# EAGLE design Tracksoar v2 sd shield (EAGLE 9.3.1)
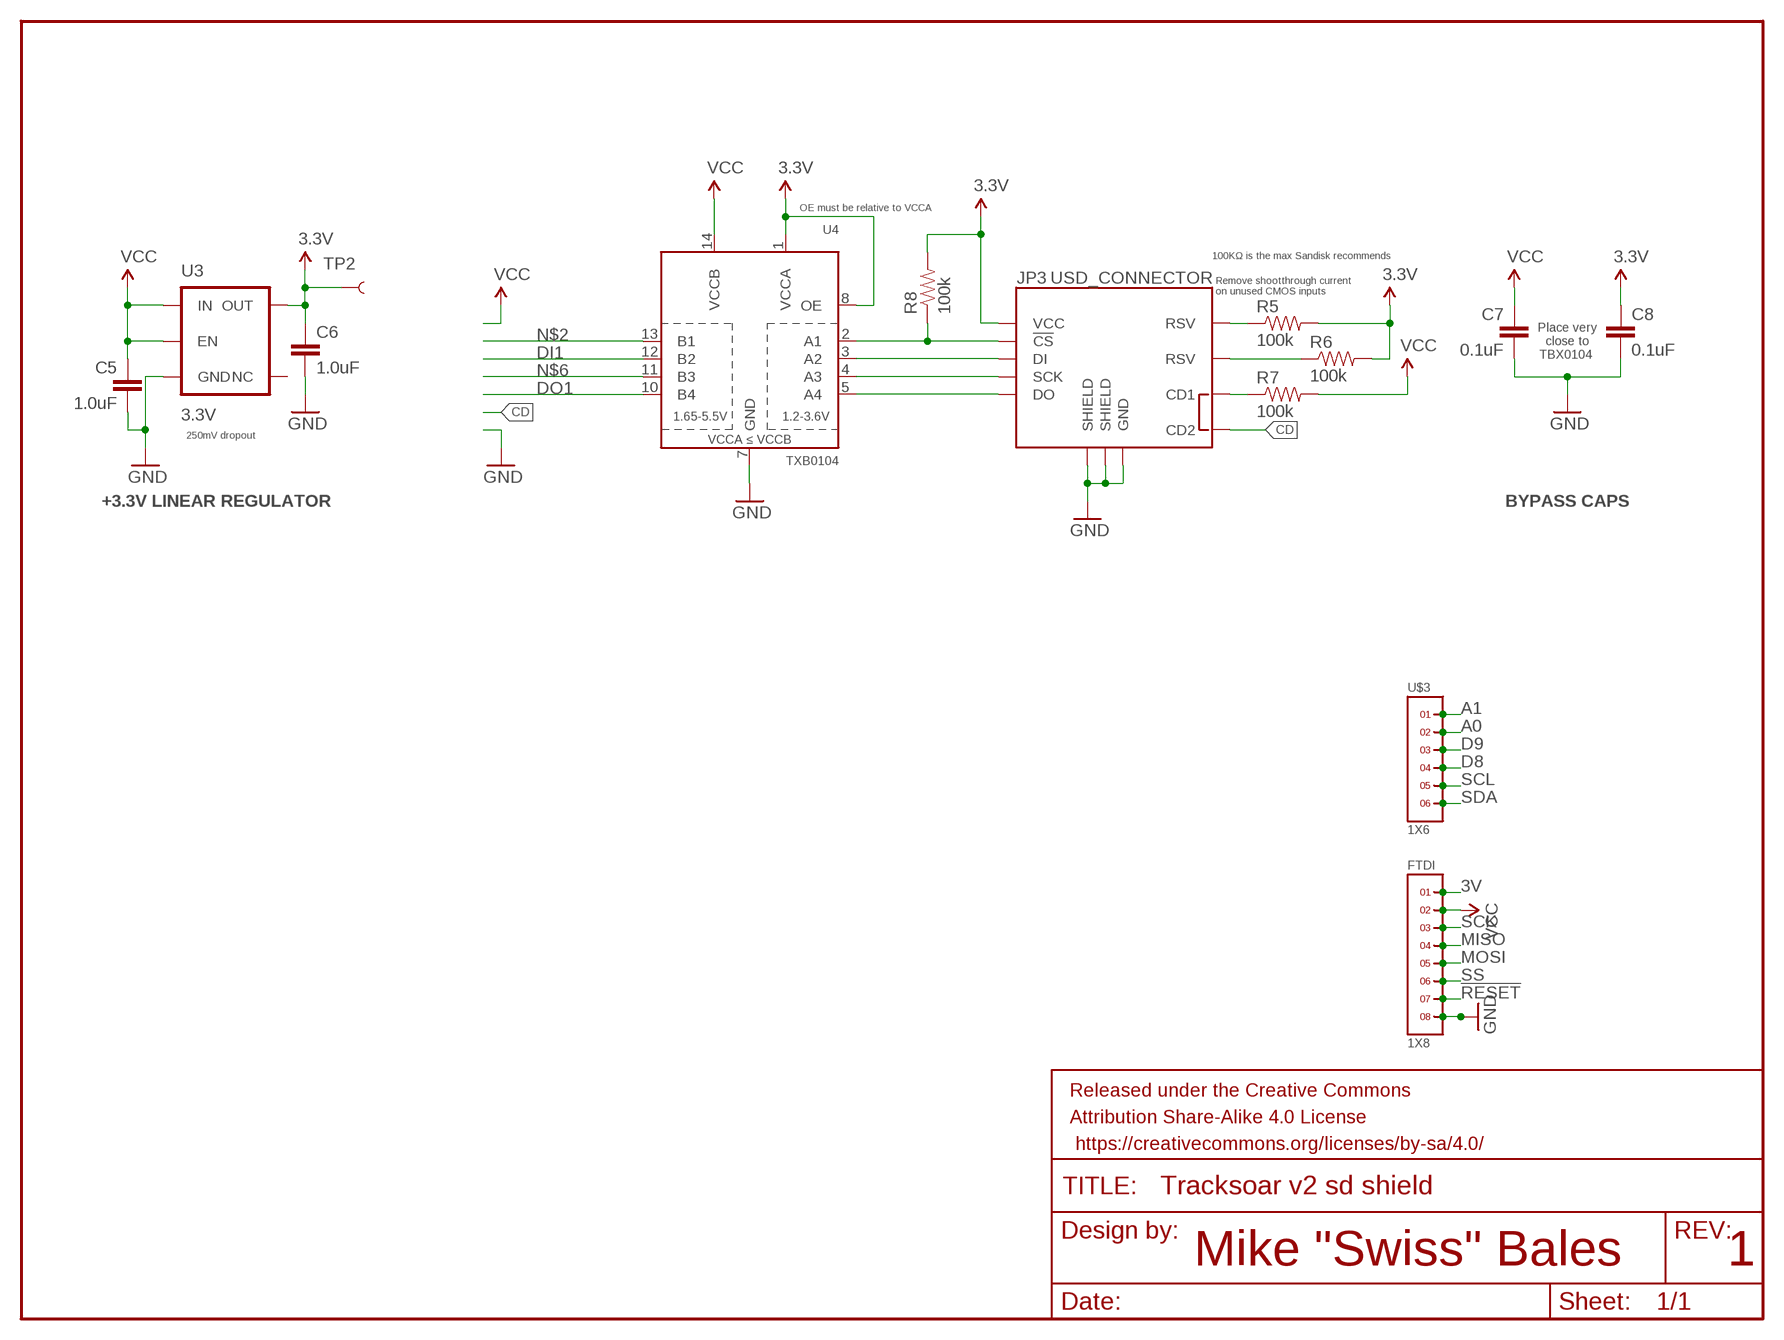
[diagram p0: schematic, sheet 1]

## Parts
C5  1.0uF  1.0UF-16V-10%(0603)  [0603-CAP]
C6  1.0uF  1.0UF-16V-10%(0603)  [0603-CAP]
C7  0.1uF  0.1UF-25V(+80/-20%)(0603)  [0603-CAP]
C8  0.1uF  0.1UF-25V(+80/-20%)(0603)  [0603-CAP]
FRAME1  FRAME-LETTER  [CREATIVE_COMMONS]
FTDI  1X8  [1X8]
JP3  USD_CONNECTOR  [MICRO-SD-SOCKET-PP]
R5  100k  100KOHM-1/10W-1%(0603)  [0603-RES]
R6  100k  100KOHM-1/10W-1%(0603)  [0603-RES]
R7  100k  100KOHM-1/10W-1%(0603)  [0603-RES]
R8  100k  100KOHM-1/10W-1%(0603)  [0603-RES]
TP2  TEST-POINT3  [PAD.03X.03]
U3  3.3V  V_REG_AP2112K-3.3V  [SOT23-5]
U4  TXB0104  TXB0104PWRSOIC14  [SO14]
U$3  1X6  [1X6]

## Nets
3V: FTDI.1
3V3: C6.1 C8.1 JP3.VCC R5.2 R6.2 R8.2 TP2.P$1 U3.5(OUT) U4.1(VCCA) U4.8(OE) ; supply symbol labelled 3.3V
!CS_3V1: JP3.CS(!CS) R8.1 U4.2(A1)
!RESET: FTDI.7
A0: U$3.2
A1: U$3.1
CD: JP3.CD2
CDSDSD1: JP3.CD1 R7.1
D8: U$3.4
D9: U$3.3
DI1: U4.12(B2)
DI_3V1: JP3.DI U4.3(A2)
DO1: U4.10(B4)
DO_3V1: JP3.DO U4.5(A4)
GND: C5.2 C6.2 C7.2 C8.2 FTDI.8 JP3.GND JP3.GND1(SHIELD) JP3.GND3(SHIELD) U3.2(GND) U4.7(GND)
MISO: FTDI.4
MOSI: FTDI.5
N$2: U4.13(B1)
N$6: U4.11(B3)
RSV@3: JP3.RSV1(RSV) R5.1
RSV@4: JP3.RSV2(RSV) R6.1
SCK: FTDI.3
SCK_3V1: JP3.SCLK(SCK) U4.4(A3)
SCL: U$3.5
SDA: U$3.6
SS: FTDI.6
VCC: FTDI.2
VDD_IO: C5.1 C7.1 R7.2 U3.1(IN) U3.3(EN) U4.14(VCCB) ; supply symbol labelled VCC
Unconnected: U3.4(NC)

## Notes on the sheet
- OE must be relative to VCCA
- 100KΩ is the max Sandisk recommends
- Remove shootthrough current
  on unused CMOS inputs
- Place very
  close to
  TBX0104
- 250mV dropout
- +3.3V LINEAR REGULATOR | BYPASS CAPS
- Mike "Swiss" Bales | 1

## Library data of the parts
C5 C6 = SparkFun-Capacitors:1.0UF-16V-10%(0603): CAP-00868; PROD_ID: CAP-00868
C7 C8 = SparkFun-Capacitors:0.1UF-25V(+80/-20%)(0603): CAP-00810 Ceramic Standard decoupling cap; PROD_ID: CAP-00810
FRAME1 = SparkFun-Aesthetics:FRAME-LETTER: Schematic Frame Standard 8.5x11 US Letter frame
FTDI = headers(2mm):1X8
JP3 = SparkFun-Connectors:USD_CONNECTOR: microSD Socket Push-push type µSD socket. Footprint production proven. Symbol has new and improved layout and naming accuracy. SparkFun Electronics SKU : PRT-00127. tDoc lines correctly indicate media card edge positions when inserting (unlocked, locked, depressed). NOTE: CD1 and CD2 are connected internally; PROD_ID: CONN-07820
R5-R8 = SparkFun-Resistors:100KOHM-1/10W-1%(0603): RES-07828; PROD_ID: RES-07828
TP2 = SparkFun-Passives:TEST-POINT: Bare copper test points for troubleshooting or ICT
U3 = SparkFun-PowerIC:V_REG_AP2112: AP2112 - 600mA CMOS LDO Regulator w/ Enable The AP2112 is CMOS process low dropout linear regulator with enable function, the regulator delivers a guaranteed 600mA (min.) continuous load current. Features Output Voltage Accuracy: ±1.5% Output Current: 600mA (Min.) Foldback Short Current Protection: 50mA Enable Function to Turn ON/OFF VOUT Low Dropout Voltage (3.3V): 250mV (Typ.) @IOUT=600mA Excellent Load Regulation: 0.2%/A (Typ.) Excellent Line Regulation: 0.02%/V (Typ.) Low Quiescent Current: 55μA (Typ.) Low Standby Current: 0.01μA (Typ.) Low Output Noise: 50μVRMS PSRR: 100Hz -65dB, 1kHz -65dB OTSD Protection Stable with 1.0μF Flexible Cap: Ceramic, Tantalum and Aluminum Electrolytic Operation Temperature Range: -40°C to 85°C ESD: MM 400V, HBM 4000V; PROD_ID: VREG-12457
U4 = SparkFun-DigitalIC:TXB0104PWR: 4-Bit Bi-Directional Level Shifter 1.2V-3.6V (VCCA) to 1.65V-5.5V (VCCB) bi-directional level shifter with auto direction sensing. Max data rate - VCCA 1.8V: 20Mbps (50ns), VCCA 3.3V: 100Mbps (10ns) Digikey: 296-21929-1-ND (TSSOP) IC-11329; PROD_ID: IC-11329
U$3 = headers(2mm):1X6

## Board
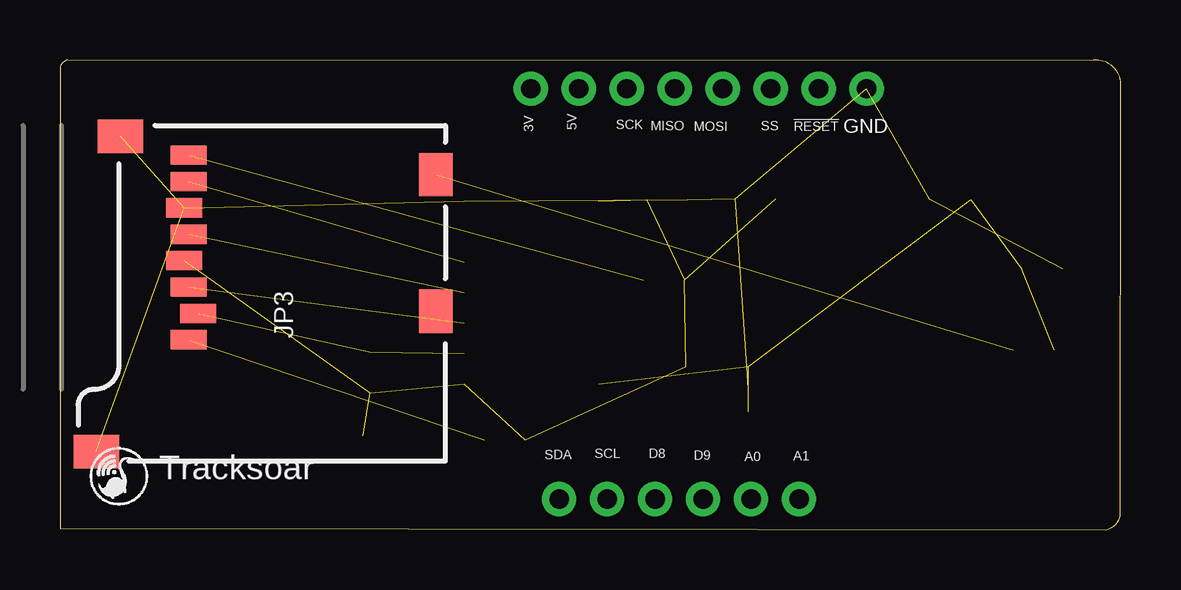
[diagram p1: board, top side]
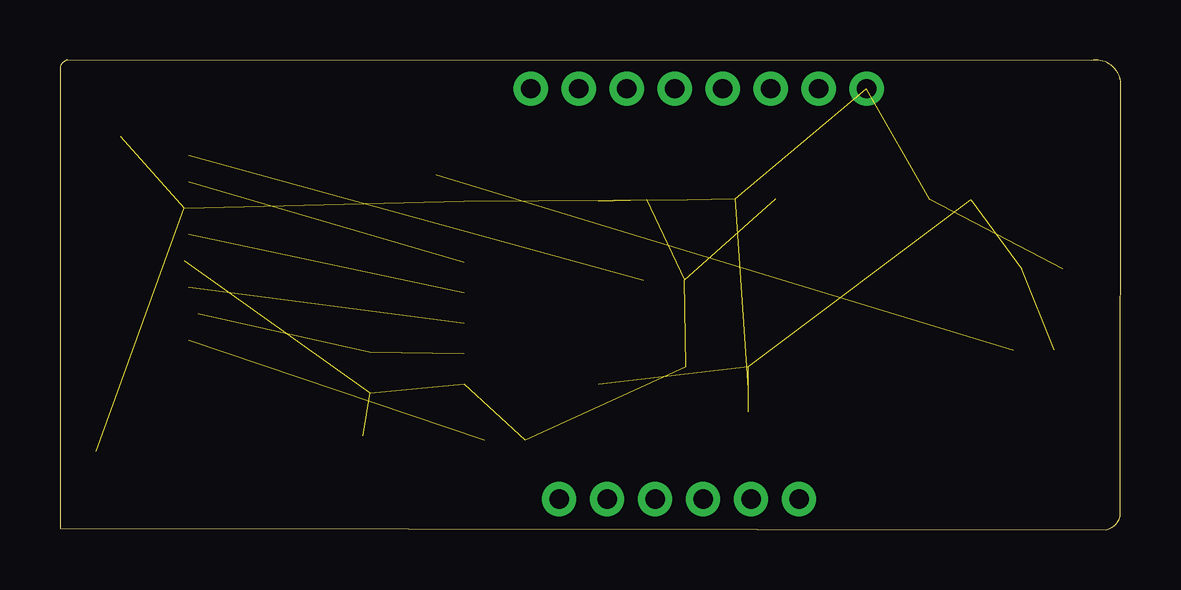
[diagram p2: board, inner layer Route2]
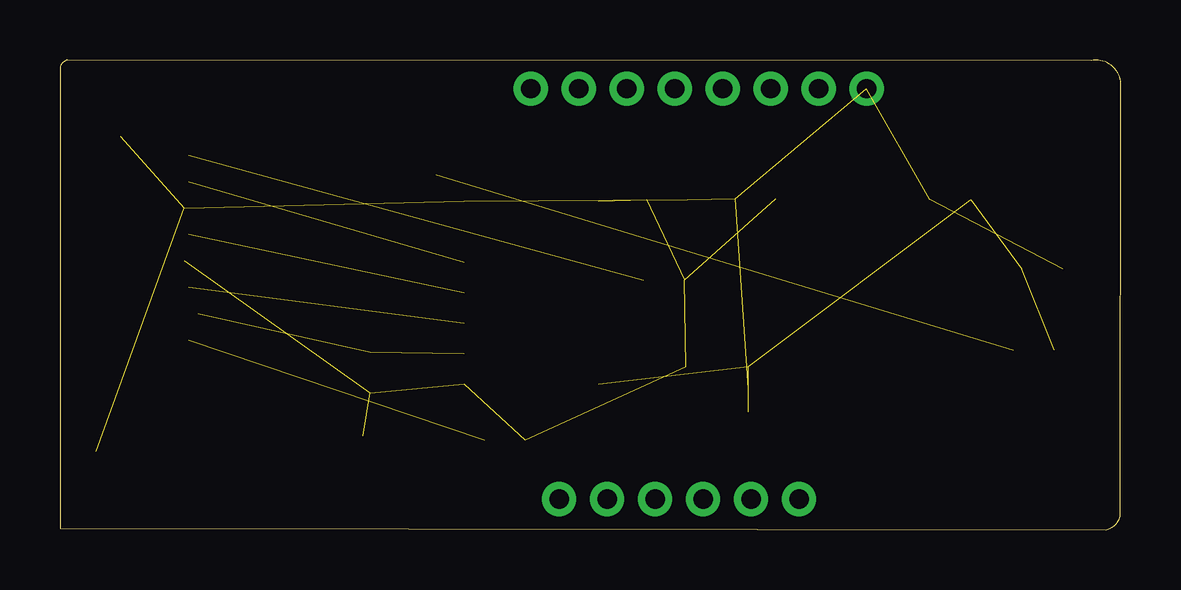
[diagram p3: board, inner layer Route15]
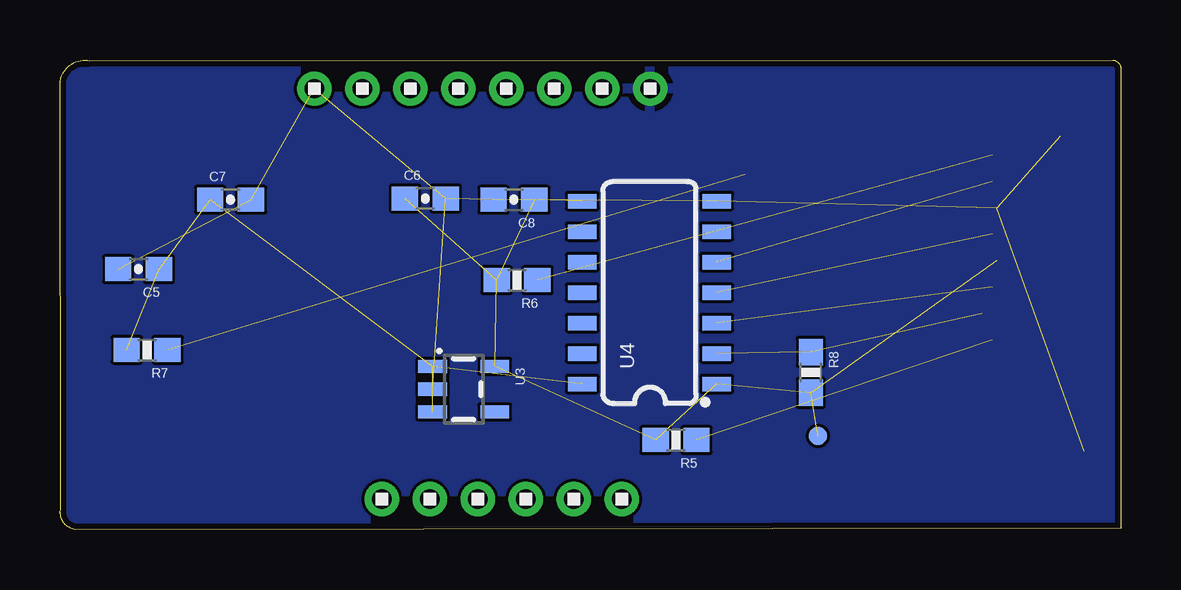
[diagram p4: board, bottom side, seen from below]

Size 44.22 x 19.58 mm. Coordinates in mm from the lower left corner, seen from the top.
Outline: 43.59,0 arc90 44.2,0.81 44.22,18.69 arc90 42.98,19.56 0.33,19.58 arc90 0,19.15 0,0.05 43.59,0
Copper layers (1*2*15*16): Top 0.035mm / dielectric 0.23mm / Route2 0.035mm / dielectric 0.93mm / Route15 0.035mm / dielectric 0.23mm / Bottom 0.035mm
Design rules "MF_Standard_4_Layer": minimum track width 5mil, minimum drill 12mil, track to track 5mil, track to pad 5mil, pad to pad 5mil, via to via 5mil, smd to smd 0mil, copper to edge 10mil, drill to drill 10mil, minimum pad ring 6mil, minimum via ring 6mil, stop-mask expansion 2mil, vias tented up to drill 25mil, thermal gap 10mil

### Footprints (pad centres in the part's own frame; a part is rotated, then mirrored left to right if it is on the bottom)
0603-CAP = smd 1.1 x 1: 1 -0.85,0; 2 0.85,0
1X8 = drill 0.8 pad 1.422: 1 -7,0; 2 -5,0; 3 -3,0; 4 -1,0; 5 1,0; 6 3,0; 7 5,0; 8 7,0
MICRO-SD-SOCKET-PP = smd 1.8 x 1.4: CD1 -2.05,0.4; CD2 -7.75,0.4 | smd 0.8 x 1.5: CS -7.84,10.3; DI -6.74,10.7; DO -2.34,10.7; GND -3.44,10.9; RSV1 -8.94,10.7; RSV2 -1.24,10.7; SCLK -4.54,10.7; VCC -5.64,10.9 | smd 1.4 x 1.9: GND1 -13.6,14.55; GND3 -0.45,13.55
0603-RES = smd 1.1 x 1: 1 -0.85,0; 2 0.85,0
PAD.03X.03 = smd 0.762 x 0.762: P$1 0,0
SOT23-5 = smd 0.55 x 1.2: 1 -0.95,-1.3; 2 0,-1.3; 3 0.95,-1.3; 4 0.95,1.3; 5 -0.95,1.3
SO14 = smd 0.6 x 1.2: 1 -3.81,-2.8; 2 -2.54,-2.8; 3 -1.27,-2.8; 4 0,-2.8; 5 1.27,-2.8; 6 2.54,-2.8; 7 3.81,-2.8; 8 3.81,2.8; 9 2.54,2.8; 10 1.27,2.8; 11 0,2.8; 12 -1.27,2.8; 13 -2.54,2.8; 14 -3.81,2.8
1X6 = drill 0.8 pad 1.422: 1 -5,0; 2 -3,0; 3 -1,0; 4 1,0; 5 3,0; 6 5,0

### Placement (x,y rotation side)
C5  40.95,10.86 180 bottom
C6  29,13.8 0 bottom
C7  37.11,13.75 0 bottom
C8  25.3,13.75 180 bottom
FRAME1  -0.56,-38.1 0 top  (outside the outline)
FTDI  26.62,18.39 180 bottom
JP3  16.07,16.85 90 top
R5  18.55,3.73 180 bottom
R6  25.17,10.4 180 bottom
R7  40.59,7.49 180 bottom
R8  12.93,6.55 270 bottom
TP2  12.63,3.91 270 bottom
U3  27.4,5.85 270 bottom
U4  19.65,9.88 90 bottom
U$3  25.81,1.27 0 bottom

### Tracks (layer width: path | path; a pad name or v marks a point on that pad's centre or on a via)
3V
  pour Bottom: 0.05,19.56 44.2,19.56 44.2,-0.15 0.05,-0.15
3V3  (9 unrouted)
!CS_3V1  (2 unrouted)
CDSDSD1  (1 unrouted)
DI_3V1  (1 unrouted)
DO_3V1  (1 unrouted)
GND  (9 unrouted)
  pour Route2: -42.64,-10.46 1.45,-10.46 1.45,-29.95 -42.64,-29.95
RSV@3  (1 unrouted)
RSV@4  (1 unrouted)
SCK_3V1  (1 unrouted)
VCC
  pour Route15: -42.67,-10.36 1.45,-10.36 1.45,-30.02 -42.67,-30.02
VDD_IO  (5 unrouted)

### Text on the board
tNames: 3V | 5V | SCK | MISO | MOSI | SS | !RESET | GND | SDA | SCL | D8 | D9 | A0 | A1 | Tracksoar
Measures: All Units in Inches
tDocu: Brent Wilkins